# EAGLE schematic FRDM-Robot-Rev1.3 (EAGLE 6.4)
FRDM-Robot Board
REV: 1.3
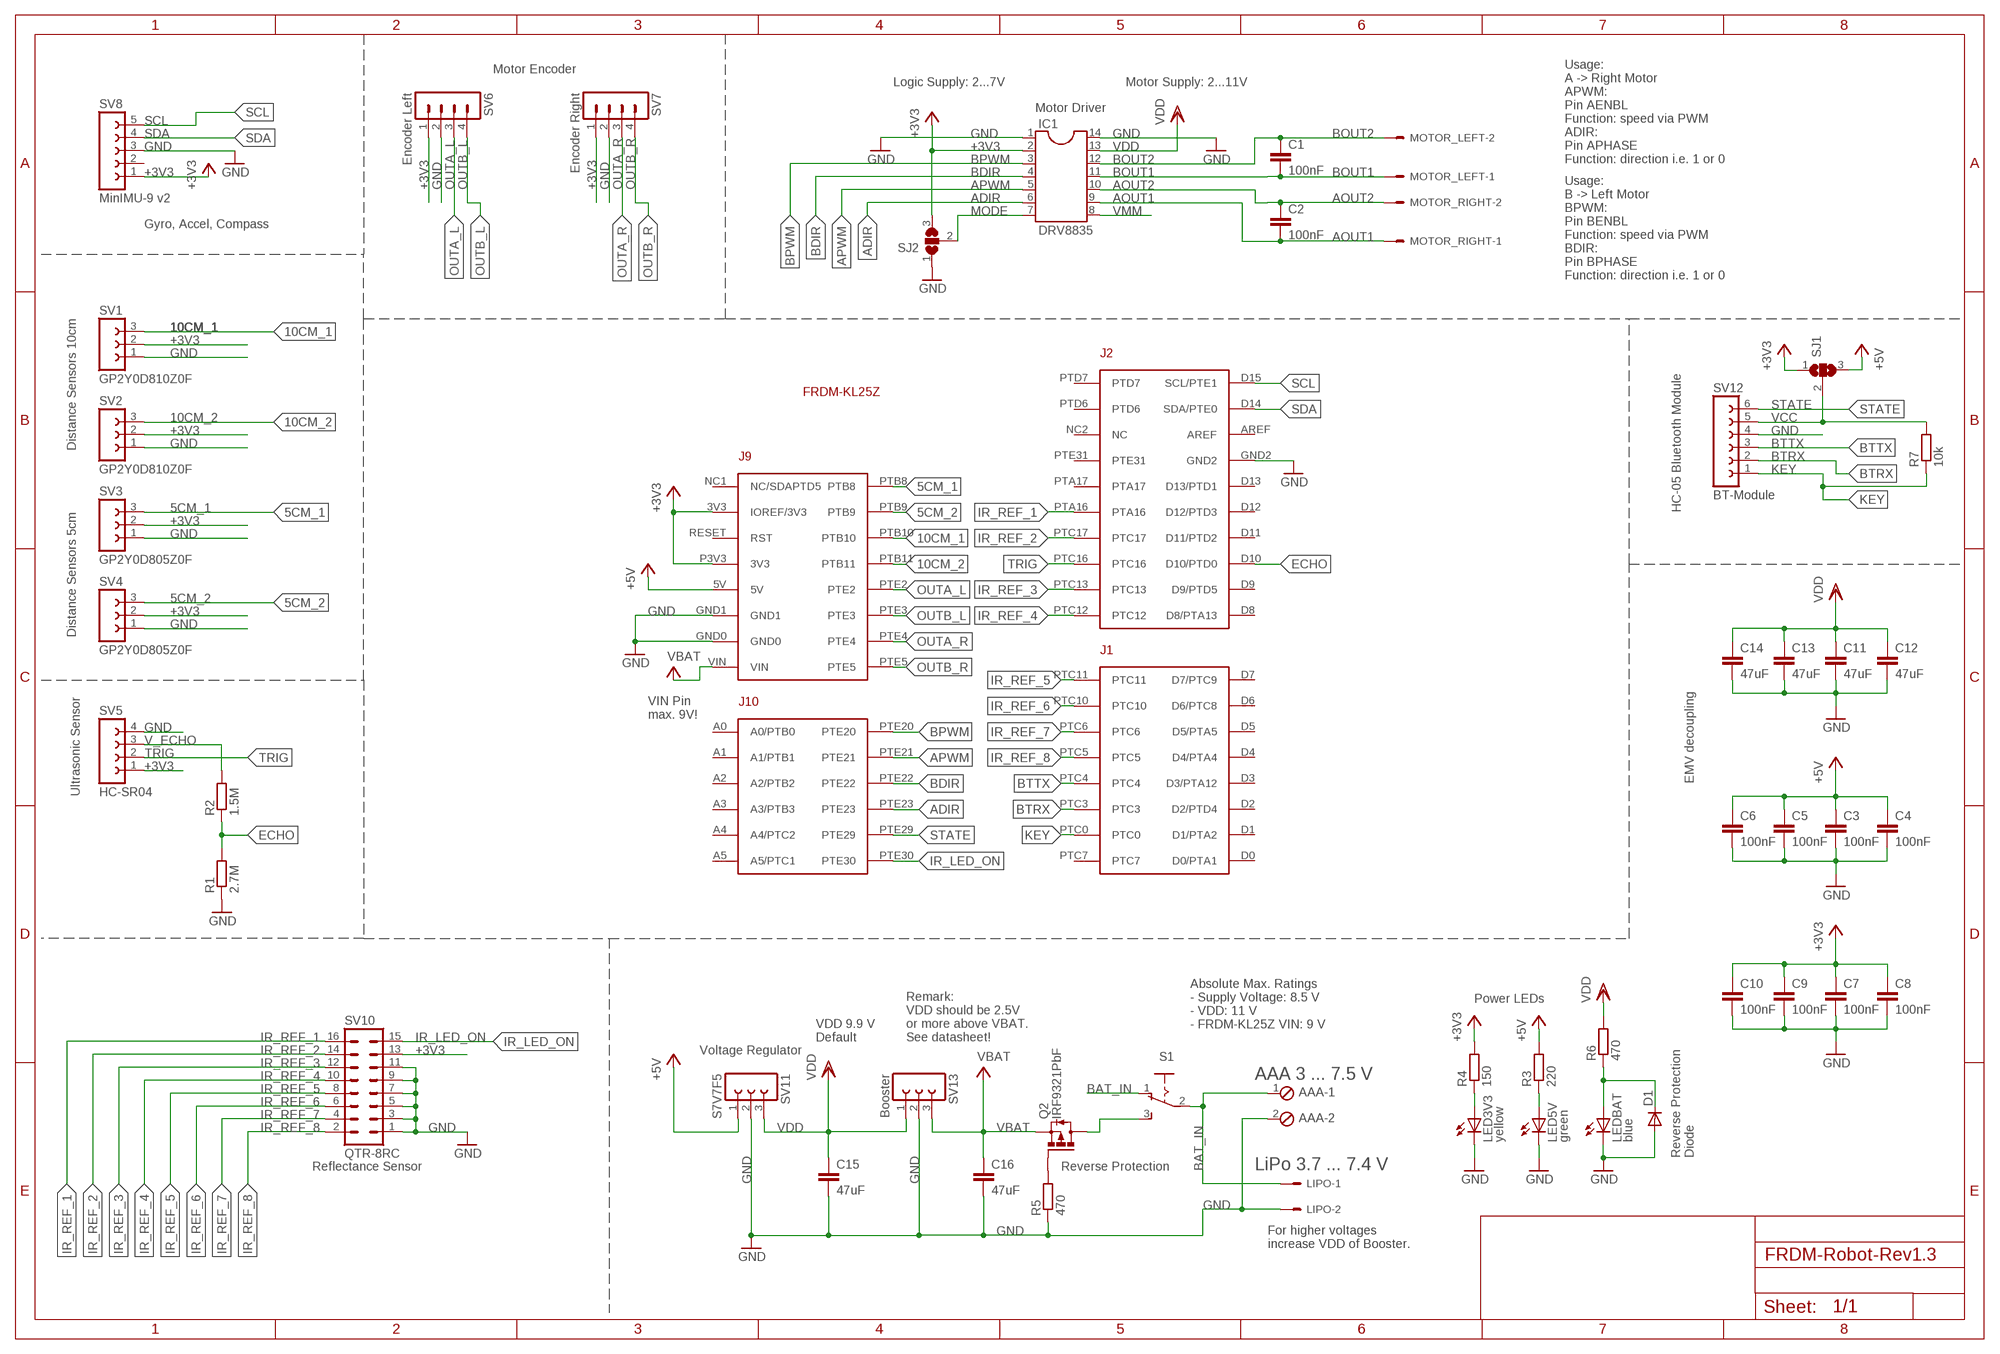
[diagram p0: schematic, sheet 1]

## Parts
AAA  MPT2  [2POL254]
C1  100nF  C-EUC0805  [C0805]
C2  100nF  C-EUC0805  [C0805]
C3  100nF  C-EUC0805  [C0805]
C4  100nF  C-EUC0805  [C0805]
C5  100nF  C-EUC0805  [C0805]
C6  100nF  C-EUC0805  [C0805]
C7  100nF  C-EUC0805  [C0805]
C8  100nF  C-EUC0805  [C0805]
C9  100nF  C-EUC0805  [C0805]
C10  100nF  C-EUC0805  [C0805]
C11  47uF  C-EUC0805  [C0805]
C12  47uF  C-EUC0805  [C0805]
C13  47uF  C-EUC0805  [C0805]
C14  47uF  C-EUC0805  [C0805]
C15  47uF  C-EUC0805  [C0805]
C16  47uF  C-EUC0805  [C0805]
D1  DIODE-SOD123  [SOD123]
FRDM1  FRDM-KL25ZARDUINO  [FRDM-KL25Z]
IC1  DRV8835  DIL14  [DIL14]
LED3V3  yellow  LEDCHIP-LED0603  [CHIP-LED0603]
LED5V  green  LEDCHIP-LED0603  [CHIP-LED0603]
LEDBAT  blue  LEDCHIP-LED0603  [CHIP-LED0603]
LIPO  KK-156-2  [KK-156-2]
MOTOR_LEFT  KK-156-2  [KK-156-2]
MOTOR_RIGHT  KK-156-2  [KK-156-2]
Q2  IRF9321PbF  P-MOSFET-SO8  [SO-08]
R1  2.7M  R-EU_M0805  [M0805]
R2  1.5M  R-EU_M0805  [M0805]
R3  220  R-EU_M0805  [M0805]
R4  150  R-EU_M0805  [M0805]
R5  470  R-EU_M0805  [M0805]
R6  470  R-EU_M0805  [M0805]
R7  10k  R-EU_M0805  [M0805]
S1  KNITTER-MFP106D  [KNITTER-MFP106D]
SJ1  SJ2W  [SJ_2]
SJ2  SJ2W  [SJ_2]
SV1  GP2Y0D810Z0F  FE03-1  [FE03-1]
SV2  GP2Y0D810Z0F  FE03-1  [FE03-1]
SV3  GP2Y0D805Z0F  FE03-1  [FE03-1]
SV4  GP2Y0D805Z0F  FE03-1  [FE03-1]
SV5  HC-SR04  FE04-1  [FE04-1]
SV6  Encoder Left  MA04-1  [MA04-1]
SV7  Encoder Right  MA04-1  [MA04-1]
SV8  MinIMU-9 v2  FE05-1  [FE05-1]
SV10  QTR-8RC  MA08-2  [MA08-2]
SV11  S7V7F5  FE03-1  [FE03-1]
SV12  BT-Module  FE06-1  [FE06]
SV13  Booster  FE03-1  [FE03-1]

## Nets
5CM_1: FRDM1.PTB8 SV3.3
5CM_2: FRDM1.PTB9 SV4.3
10CM_1: FRDM1.PTB10 SV1.3
10CM_2: FRDM1.PTB11 SV2.3
+3V3: C7.1 C8.1 C9.1 C10.1 FRDM1.3V3(IOREF/3V3) FRDM1.P3V3(3V3) IC1.2 R4.2 SJ1.1 SJ2.3 SV1.2 SV2.2 SV3.2 SV4.2 SV5.1 SV6.1 SV7.1 SV8.1 SV10.13
+5V: C3.1 C4.1 C5.1 C6.1 FRDM1.5V R3.2 SJ1.3 SV11.1
ADIR: FRDM1.PTE23 IC1.6
AOUT1: C2.2 IC1.9 MOTOR_RIGHT.1
AOUT2: C2.1 IC1.10 MOTOR_RIGHT.2
APWM: FRDM1.PTE21 IC1.5
BAT-FET: Q2.5(D) Q2.6(D) Q2.7(D) Q2.8(D) S1.3(S)
BAT_IN: AAA.1 LIPO.1 S1.1(O) S1.2(P)
BDIR: FRDM1.PTE22 IC1.4
BOUT1: C1.2 IC1.11 MOTOR_LEFT.1
BOUT2: C1.1 IC1.12 MOTOR_LEFT.2
BPWM: FRDM1.PTE20 IC1.3
BTRX: FRDM1.PTC3 SV12.2
BTTX: FRDM1.PTC4 SV12.3
ECHO: FRDM1.D10(D10/PTD0) R1.2 R2.1
GND: AAA.2 C3.2 C4.2 C5.2 C6.2 C7.2 C8.2 C9.2 C10.2 C11.2 C12.2 C13.2 C14.2 C15.2 C16.2 D1.A FRDM1.GND0 FRDM1.GND1 FRDM1.GND2 IC1.1 IC1.14 LED3V3.C LED5V.C LEDBAT.C LIPO.2 R1.1 R5.1 SJ2.1 SV1.1 SV2.1 SV3.1 SV4.1 SV5.4 SV6.2 SV7.2 SV8.3 SV10.1 SV10.3 SV10.5 SV10.7 SV10.9 SV10.11 SV11.2 SV12.4 SV13.2
IR_LED_ON: FRDM1.PTE30 SV10.15
IR_REF_1: FRDM1.PTA16 SV10.16
IR_REF_2: FRDM1.PTC17 SV10.14
IR_REF_3: FRDM1.PTC13 SV10.12
IR_REF_4: FRDM1.PTC12 SV10.10
IR_REF_5: FRDM1.PTC11 SV10.8
IR_REF_6: FRDM1.PTC10 SV10.6
IR_REF_7: FRDM1.PTC6 SV10.4
IR_REF_8: FRDM1.PTC5 SV10.2
KEY: FRDM1.PTC0 R7.1 SV12.1
MODE: IC1.7 SJ2.2
N$1: LED5V.A R3.1
N$3: LED3V3.A R4.1
N$5: Q2.4(G) R5.2
N$6: D1.C LEDBAT.A R6.1
OUTA_L: FRDM1.PTE2 SV6.3
OUTA_R: FRDM1.PTE4 SV7.3
OUTB_L: FRDM1.PTE3 SV6.4
OUTB_R: FRDM1.PTE5 SV7.4
SCL: FRDM1.D15(SCL/PTE1) SV8.5
SDA: FRDM1.D14(SDA/PTE0) SV8.4
STATE: FRDM1.PTE29 SV12.6
TRIG: FRDM1.PTC16 SV5.2
V+: FRDM1.VIN ; supply symbol labelled VBAT
V_ECHO: R2.2 SV5.3
VBAT: C16.1 Q2.1(S) Q2.2(S) Q2.3(S) SV13.3
VCC: R7.2 SJ1.2 SV12.5
VDD: C11.1 C12.1 C13.1 C14.1 C15.1 IC1.13 R6.2 SV11.3 SV13.1
VMM: IC1.8
Unconnected: FRDM1.A0(A0/PTB0) FRDM1.A1(A1/PTB1) FRDM1.A2(A2/PTB2) FRDM1.A3(A3/PTB3) FRDM1.A4(A4/PTC2) FRDM1.A5(A5/PTC1) FRDM1.AREF FRDM1.D0(D0/PTA1) FRDM1.D1(D1/PTA2) FRDM1.D2(D2/PTD4) FRDM1.D3(D3/PTA12) FRDM1.D4(D4/PTA4) FRDM1.D5(D5/PTA5) FRDM1.D6(D6/PTC8) FRDM1.D7(D7/PTC9) FRDM1.D8(D8/PTA13) FRDM1.D9(D9/PTD5) FRDM1.D11(D11/PTD2) FRDM1.D12(D12/PTD3) FRDM1.D13(D13/PTD1) FRDM1.NC1(NC/SDAPTD5) FRDM1.NC2(NC) FRDM1.PTA17 FRDM1.PTC7 FRDM1.PTD6 FRDM1.PTD7 FRDM1.PTE31 FRDM1.RESET(RST) SV8.2

## Notes on the sheet
- Motor Encoder
- Logic Supply: 2...7V | Motor Supply: 2...11V
- Motor Driver
- Usage:
  A -> Right Motor
  APWM: 
  Pin AENBL 
  Function: speed via PWM
  ADIR: 
  Pin APHASE 
  Function: direction i.e. 1 or 0
- Gyro, Accel, Compass
- Usage:
  B -> Left Motor
  BPWM: 
  Pin BENBL 
  Function: speed via PWM
  BDIR: 
  Pin BPHASE 
  Function: direction i.e. 1 or 0
- Distance Sensors 10cm
- Distance Sensors 5cm | HC-05 Bluetooth Module
- VIN Pin
  max. 9V!
- EMV decoupling
- Ultrasonic Sensor
- Power LEDs
- Absolute Max. Ratings
  - Supply Voltage: 8.5 V
  - VDD: 11 V
  - FRDM-KL25Z VIN: 9 V
- VDD 9.9 V
  Default
- Remark:
  VDD should be 2.5V
  or more above VBAT. 
  See datasheet!
- Voltage Regulator
- AAA 3 ... 7.5 V
- Reverse Protection
  Diode
- Reflectance Sensor | Reverse Protection | LiPo 3.7 ... 7.4 V
- For higher voltages 
  increase VDD of Booster.

## Library data of the parts
AAA = con-phoenix-254:MPT2: PHOENIX CONNECTOR; OC_FARNELL: unknown; OC_NEWARK: unknown
C1-C16 = rcl:C-EU: CAPACITOR, European symbol
D1 = diode:DIODE-: DIODE
FRDM1 = Freedom:FRDM-KL25Z: For creating FRDM-KL25Z shields
IC1 = ic-package:DIL14: Dual In Line / Socket
LED3V3 LED5V LEDBAT = led:LED: LED OSRAM: - CHIPLED LG R971, LG N971, LY N971, LG Q971, LY Q971, LO R971, LY R971 LH N974, LH R974 LS Q976, LO Q976, LY Q976 LO Q996 - Hyper CHIPLED LW Q18S LB Q993, LB Q99A, LB R99A - SideLED LS A670, LO A670, LY A670, LG A670, LP A670 LB A673, LV A673, LT A673, LW A673 LH A674 LY A675 LS A676, LA A676, LO A676, LY A676, LW A676 LS A679, LY A679, LG A679 - Hyper Micro SIDELED® LS Y876, LA Y876, LO Y876, LY Y876 LT Y87S - SmartLED LW L88C, LW L88S LB L89C, LB L89S, LG L890 LS L89K, LO L89K, LY L89K LS L896, LA L896, LO L896, LY L896 - TOPLED LS T670, LO T670, LY T670, LG T670, LP T670 LSG T670, LSP T670, LSY T670, LOP T670, LYG T670 LG T671, LOG T671, LSG T671 LB T673, LV T673, LT T673, LW T673 LH T674 LS T676, LA T676, LO T676, LY T676, LB T676, LH T676, LSB T676, LW T676 LB T67C, LV T67C, LT T67C, LS T67K, LO T67K, LY T67K, LW E67C LS E67B, LA E67B, LO E67B, LY E67B, LB E67C, LV E67C, LT E67C LW T67C LS T679, LY T679, LG T679 LS T770, LO T770, LY T770, LG T770, LP T770 LB T773, LV T773, LT T773, LW T773 LH T774 LS E675, LA E675, LY E675, LS T675 LS T776, LA T776, LO T776, LY T776, LB T776 LHGB T686 LT T68C, LB T68C - Hyper Mini TOPLED® LB M676 - Mini TOPLED Santana® LG M470 LS M47K, LO M47K, LY M47K Source: http://www.osram.convergy.de LUXEON: - LUMILED® LXK2-PW12-R00, LXK2-PW12-S00, LXK2-PW14-U00, LXK2-PW14-V00 LXK2-PM12-R00, LXK2-PM12-S00, LXK2-PM14-U00 LXK2-PE12-Q00, LXK2-PE12-R00, LXK2-PE12-S00, LXK2-PE14-T00, LXK2-PE14-U00 LXK2-PB12-K00, LXK2-PB12-L00, LXK2-PB12-M00, LXK2-PB14-N00, LXK2-PB14-P00, LXK2-PB14-Q00 LXK2-PR12-L00, LXK2-PR12-M00, LXK2-PR14-Q00, LXK2-PR14-R00 LXK2-PD12-Q00, LXK2-PD12-R00, LXK2-PD12-S00 LXK2-PH12-R00, LXK2-PH12-S00 LXK2-PL12-P00, LXK2-PL12-Q00, LXK2-PL12-R00 Source: www.luxeon.com KINGBRIGHT: KA-3528ASYC Source: www.kingbright.com
LIPO MOTOR_LEFT MOTOR_RIGHT = con-molex:KK-156-2: KK 156 HEADER Source: http://www.molex.com/pdm_docs/sd/026604100_sd.pdf; OC_FARNELL: unknown; OC_NEWARK: unknown
Q2 = transistor-power-IRF:P-MOSFET-SO8: P-Channel MOSFET Example: FDS4435A; P-Channel Logic Level PowerTrench® MOSFET FDS4465; P-Channel 1.8V Specified PowerTrench® MOSFET Source: www.fairchildsemi.com
R1-R7 = resistor:R-EU_: RESISTOR, European symbol
S1 = switch-SPDT:KNITTER-MFP106D: SLIDING SWITCH Knitter-Switch MFP 106 D Farnell <http://ch.farnell.com/knitter-switch/mfp106d/schiebeschalter-ein-ein/dp/807527>; FARNELL: 807527
SJ1 SJ2 = jumper:SJ2W: SMD solder JUMPER
SV1-SV4 SV11 SV13 = con-lsta-Extended:FE03-1: Female Header
SV5 = con-lsta-Extended:FE04-1: Female Header
SV6 SV7 = con-lstb:MA04-1: PIN HEADER; OC_FARNELL: unknown; OC_NEWARK: unknown
SV8 = con-lsta:FE05-1: FEMALE HEADER; OC_FARNELL: unknown; OC_NEWARK: unknown
SV10 = con-lstb:MA08-2: PIN HEADER; OC_FARNELL: unknown; OC_NEWARK: unknown
SV12 = con-lsta:FE06-1: FEMALE HEADER; OC_FARNELL: unknown; OC_NEWARK: unknown